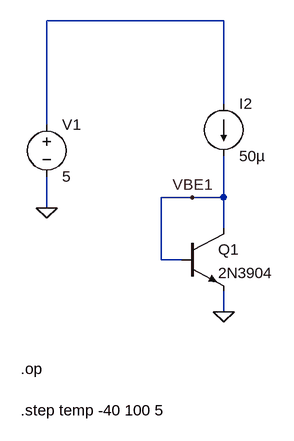
[diagram p0: schematic CTAT.asc]
CTAT.asc, the LTspice schematic file:
Version 4
SHEET 1 880 680
WIRE -320 -688 -592 -688
WIRE -320 -560 -320 -688
WIRE -592 -528 -592 -688
WIRE -368 -416 -416 -416
WIRE -320 -416 -320 -480
WIRE -320 -416 -368 -416
WIRE -592 -400 -592 -448
WIRE -320 -368 -320 -416
WIRE -416 -320 -416 -416
WIRE -384 -320 -416 -320
WIRE -320 -240 -320 -272
FLAG -320 -240 0
FLAG -368 -416 VBE1
FLAG -592 -400 0
SYMBOL npn -384 -368 R0
SYMATTR InstName Q1
SYMATTR Value 2N3904
SYMBOL current -320 -560 R0
WINDOW 123 0 0 Left 0
WINDOW 39 0 0 Left 0
SYMATTR InstName I2
SYMATTR Value 50µ
SYMBOL voltage -592 -544 R0
WINDOW 123 0 0 Left 0
WINDOW 39 0 0 Left 0
SYMATTR InstName V1
SYMATTR Value 5
TEXT -632 -152 Left 2 !.op
TEXT -632 -88 Left 2 !.step temp -40 100 5

The netlist it stands for:
* CTAT.asc
Q1 VBE1 VBE1 0 0 2N3904
I2 N001 VBE1 50µ
V1 N001 0 5
.model NPN NPN
.model PNP PNP
.lib standard.bjt
.op
.step temp -40 100 5
.backanno
.end